# EAGLE schematic KNLWiring (EAGLE 7.6.0)
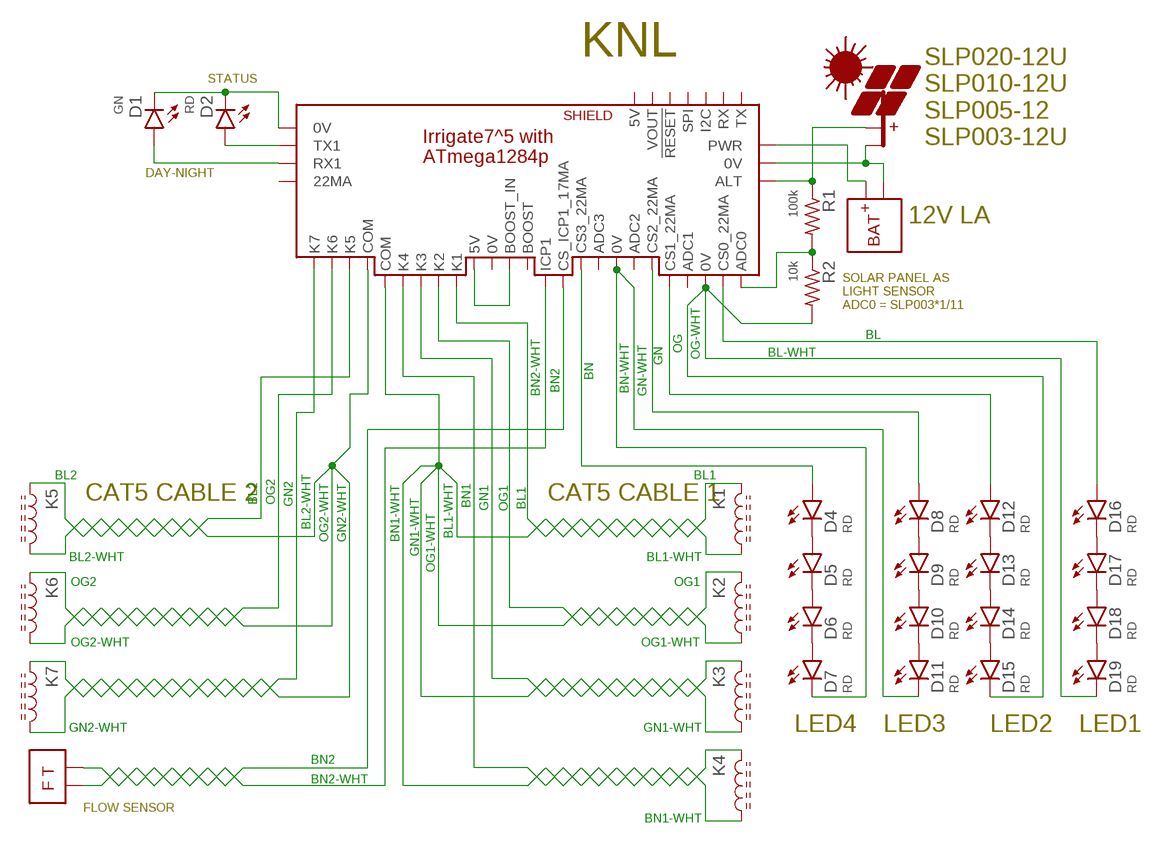
[diagram p0: schematic, sheet 1]

## Parts
D1  GN  LED5MM  [LED5MM]
D2  RD  LED5MM  [LED5MM]
D4  RD  LED5MM  [LED5MM]
D5  RD  LED5MM  [LED5MM]
D6  RD  LED5MM  [LED5MM]
D7  RD  LED5MM  [LED5MM]
D8  RD  LED5MM  [LED5MM]
D9  RD  LED5MM  [LED5MM]
D10  RD  LED5MM  [LED5MM]
D11  RD  LED5MM  [LED5MM]
D12  RD  LED5MM  [LED5MM]
D13  RD  LED5MM  [LED5MM]
D14  RD  LED5MM  [LED5MM]
D15  RD  LED5MM  [LED5MM]
D16  RD  LED5MM  [LED5MM]
D17  RD  LED5MM  [LED5MM]
D18  RD  LED5MM  [LED5MM]
D19  RD  LED5MM  [LED5MM]
K1  L0805  [C0805(2012)]
K2  L0805  [C0805(2012)]
K3  L0805  [C0805(2012)]
K4  L0805  [C0805(2012)]
K5  L0805  [C0805(2012)]
K6  L0805  [C0805(2012)]
K7  L0805  [C0805(2012)]
PV4  PV  [NA-30]
R1  100k  R0805  [C0805(2012)]
R2  10k  R0805  [C0805(2012)]
U$1  IRRIGATE7  [WITH_RPU_NAMES]
U$3  FT  [NA-30]
U$7  BAT  [NA-30]

## Nets
0V: PV4.2(-PV) U$1.0V@PWR(0V) U$7.2(-BAT)
BL: D16.A U$1.22MA@ADC0(CS0_22MA)
BL1: K1.1 U$1.K1
BL1-WHT: K1.2
BL2: K5.1 U$1.K5
BL2-WHT: K5.2
BL-WHT: D19.K
BN: D4.A U$1.22MA@ADC5(CS3_22MA)
BN1: K4.1 U$1.K4
BN1-WHT: K4.2
BN2: U$1.17MA@ICP1(CS_ICP1_17MA) U$3.2(PWR)
BN2-WHT: U$1.ICP1 U$3.1(PL)
BN-WHT: D7.K
GN: D8.A U$1.22MA@ADC4(CS2_22MA)
GN1: K3.1 U$1.K3
GN1-WHT: K3.2
GN2: K7.1 U$1.K7
GN2-WHT: K7.2
GN-WHT: D11.K U$1.ICP3(0V)
N$1: U$1.PWR U$7.1(+BAT)
N$2: R2.2
N$3: D1.K D2.K U$1.17MA@ICP3(0V)
N$4: D4.K D5.A
N$5: D5.K D6.A
N$6: D6.K D7.A
N$8: D8.K D9.A
N$9: D9.K D10.A
N$10: D10.K D11.A
N$12: D13.K D14.A
N$14: D14.K D15.A
N$15: D16.K D17.A
N$16: D17.K D18.A
N$17: D18.K D19.A
N$18: D12.K D13.A
N$22: R1.2 R2.1 U$1.ADC0
N$25: U$1.COM@K4(COM)
N$26: U$1.COM@K5(COM)
N$27: U$1.5V U$1.BOOST_IN
N$28: D2.A U$1.DIO3(TX1)
N$29: D1.A U$1.DIO2(RX1)
N$34: PV4.1(+PV) R1.1 U$1.AUX(ALT)
OG: D12.A U$1.22MA@ADC1(CS1_22MA)
OG1: K2.1 U$1.K2
OG1-WHT: K2.2
OG2: K6.1 U$1.K6
OG2-WHT: K6.2
OG-WHT: D15.K U$1.0V@ADC2(0V)
Unconnected: U$1.0V U$1.22MA@DIO2(22MA) U$1.!RESET U$1.ADC1 U$1.ADC4(ADC2) U$1.ADC5(ADC3) U$1.BOOST U$1.I2C U$1.RX U$1.SHLD_5V(5V) U$1.SHLD_VOUT(VOUT) U$1.SPI U$1.TX

## Notes on the sheet
- KNL
- STATUS
- SLP020-12U
  SLP010-12U
  SLP005-12
  SLP003-12U
- DAY-NIGHT
- 12V LA
- SOLAR PANEL AS
  LIGHT SENSOR
  ADC0 = SLP003*1/11
- CAT5 CABLE 2 | CAT5 CABLE 1
- LED4 | LED3 | LED2 | LED1
- FLOW SENSOR

## Library data of the parts
D1 D2 D4-D19 = D-LED:LED: LED 120120WH [CREE,XHGAWT-00-0000-00000HXE1] LED WHITE 6500K 150LUM-W120120
K1-K7 = L-PWR:L: Inductor
PV4 = Documentation:PV
R1 R2 = R-C:R: Resiistor American-style symbol
U$1 = Documentation:IRRIGATE7: BM /w 1284p
U$3 = Documentation:FT
U$7 = Documentation:BAT